# Altium schematic sheet ct_back.SchDoc: Back Panel
size Letter; Organization: NewAE Technology Inc.; Address1: 1083 Queen St., Suite 196; Address2: Halifax; Address3: NS; Address4: Canada B3H 0B2; SheetNumber: 1; SheetTotal: 8; SheetApproved: YES
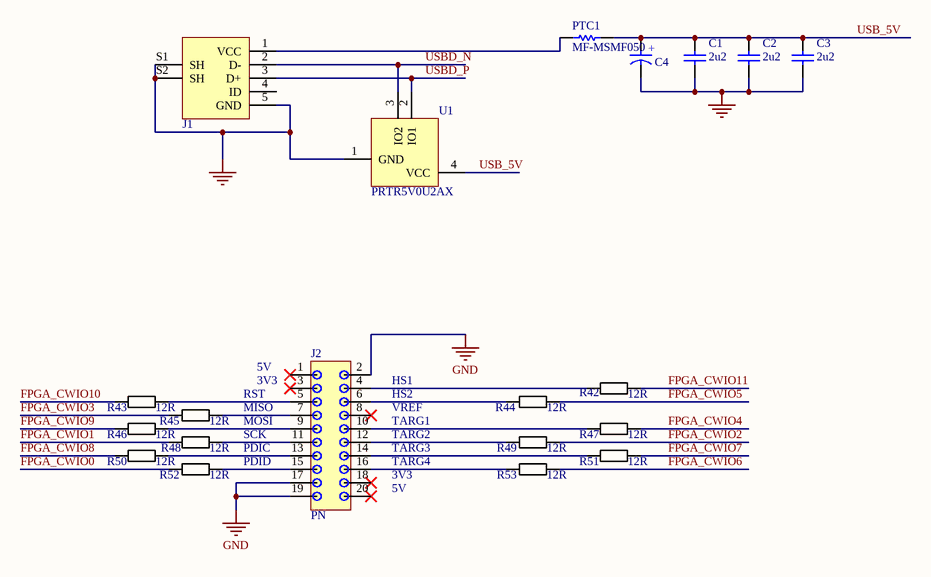
[diagram p0: ct_back.SchDoc]

## Parts
C1  2u2  [CAPC0603_M]
C2  2u2  [CAPC0603_M]
C3  2u2  [CAPC0603_M]
C4  680uF  [Cap_16v_680uF]  (value not drawn)
J1  USB_MicroB_Jack  [ZX62D-B-5P8(30)]  (value not drawn)
J2  PN  [CON-20HDR-EDGEMOUNT]
PTC1  MF-MSMF050  [BOUR-MF-MSMF050-2_V]
R42  12R  [RESC1005X40N]
R43  12R  [RESC1005X40N]
R44  12R  [RESC1005X40N]
R45  12R  [RESC1005X40N]
R46  12R  [RESC1005X40N]
R47  12R  [RESC1005X40N]
R48  12R  [RESC1005X40N]
R49  12R  [RESC1005X40N]
R50  12R  [RESC1005X40N]
R51  12R  [RESC1005X40N]
R52  12R  [RESC1005X40N]
R53  12R  [RESC1005X40N]
U1  PRTR5V0U2AX  [SOT143B]

## Nets
GND: C1.2 C2.2 C3.2 C4.2 J1.5(GND) J1.S1(SH) J1.S2(SH) J2.2 J2.17 J2.19 U1.1(GND)
FPGA_CWIO0: R52.1
FPGA_CWIO1: R48.1
FPGA_CWIO2: R49.2
FPGA_CWIO3: R45.1
FPGA_CWIO4: R47.2
FPGA_CWIO5: R44.2
FPGA_CWIO6: R53.2
FPGA_CWIO7: R51.2
FPGA_CWIO8: R50.1
FPGA_CWIO9: R46.1
FPGA_CWIO10: R43.1
FPGA_CWIO11: R42.2
USB_5V: C1.1 C2.1 C3.1 C4.1 PTC1.2 U1.4(VCC)
USBD_N: J1.2(D-) U1.3(IO2)
USBD_P: J1.3(D+) U1.2(IO1)
NetJ1_1: J1.1(VCC) PTC1.1
NetJ2_4: J2.4 R42.1
NetJ2_5: J2.5 R43.2
NetJ2_6: J2.6 R44.1
NetJ2_7: J2.7 R45.2
NetJ2_9: J2.9 R46.2
NetJ2_10: J2.10 R47.1
NetJ2_11: J2.11 R48.2
NetJ2_12: J2.12 R49.1
NetJ2_13: J2.13 R50.2
NetJ2_14: J2.14 R51.1
NetJ2_15: J2.15 R52.2
NetJ2_16: J2.16 R53.1

Not connected (* = marked no-connect by the designer): J1 4(ID); J2 1* 3* 8* 18(10)* 20(10)*

## Notes on the sheet
- RST
- MISO
- MOSI
- 5V
- 3V3
- (near J2) TARG1
- (near J2) HS1
- (near J2) HS2
- (near J2) VREF
- SCK
- PDIC
- PDID
- (near J2) TARG4
- (near J2) TARG2
- (near J2) TARG3
- (near J2) 3V3
- (near J2) 5V
- Title:
- Date:
- Rev:
- Time:
- Project:
- Sheet
- of
- License:
- Copyright © NewAE Technology Inc.
- Approved:
- NewAE.com
- File:
- (in symbol Cap_16v_680uF) +

## Library data of the parts
C1-C3 = CCHIP-2u2-0603: 2u2, 0603; Manufacture 1: Samsung; Manufacture Part Number 1: CL10B225KP8NNNC; Component Group: Capacitor; Case-EIA: 0603; Case-Metric: 1608; Rated Voltage: 10VDC; Part Number: CCHIP-2u2-0603; Footprint: 0603; Pin Count: 2; Supplier 1: Digi-Key; Supplier Part Number 1: 1276-1134-2-ND; Value: 2u2; Mounting Technology: SMT; Component Kind: Standard; Component Type: Standard
C4 = Cap_16v_680uF: Aluminum electrolytic 680uF, 8x16mm, radial; Component Group: Capacitor; PP Material Stack: 0; Part Number: Cap_16v_680uF; Pin Count: 2; Value: 680uF; Mounting Technology: Through-hole; Component Kind: Standard; Component Type: Standard; PP Rotation: 0
J1 = ZX62D-B-5P8(30): CONN RCPT USB MICRO B SMD; Manufacture 1: Hirose Electric Co Ltd; Component Group: Connector; PP Material Stack: 0; Part Number: ZX62D-B-5P8(30); Manufacture Part Number 1: ZX62D-B-5P8(30); Pin Count: 5; Supplier 1: Digi-Key; Supplier Part Number 1: H125272CT-ND; Mounting Technology: Through-hole; RoHS: Yes; Component Kind: Standard; Component Type: Standard; PP Rotation: 0
J2 = CON20HDR-EDGE: Component Group: Connector; PP Material Stack: 0; Part Number: CON20HDR-EDGE; Pin Count: 20; Component Kind: Standard; Component Type: Standard; PP Rotation: 0; Supplier Part Number 1: S9172-ND; Supplier 1: Digi-Key
PTC1 = CMP-0280-00002-2: MF-MSMF Series - PTC Resettable Fuse, 15 V Max, 0.15 Ohm Min, -40 to 85 degC, RoHS, Reel; Manufacturer: Bourns; Voltage DC (Max): 15 V; Trip Current: 1 A; Hold Current: 0.5 A; Current Rating (Max): 100 A; ComponentLink1Description: Manufacturer URL; Operating Temperature Range: -40 to 85 degC; ComponentLink2URL: http://www.bourns.com/data/global/pdfs/mfmsmf.pdf; PackageReference: MF-MSMF050; ComponentLink2Description: Datasheet; PartNumber: MF-MSMF050; DatasheetVersion: Rev. AD; ComponentLink3URL: http://www.bourns.com/data/global/pdfs/mfmsmf.pdf; ComponentLink3Description: Package Specification; RoHS: TRUE; PackageDescription: 2-Pin SMD, Body 4.55 x 3.24 mm; Mounting Technology: Surface Mount; Packing: Reel; Resistance (Min): 0.15 Ohm; ComponentLink1URL: http://www.bourns.com/; Supplier 1: Digi-Key; Supplier Part Number 1: MF-MSMF050-2CT-ND
R42-R53 = RCHIP-12R-0402: 12R res, 0402, 1%, 1/16W; Manufacture 1: Yageo; Manufacture Part Number 1: RC0402FR-0712RL; Component Group: Resistor; Case-EIA: 0402; Case-Metric: 1005; Rated Power: 0.063W; Rated Voltage: 75VDC; Part Number: RCHIP-12R-0402; Footprint: 0402; Pin Count: 2; Supplier 1: Digi-Key; Supplier Part Number 1: YAG2968CT-ND; Value: 12R; Tolerance: 1%; Mounting Technology: SMT; Temperature Range: -55C to 155C; Component Kind: Standard; Component Type: Standard
U1 = PRTR5V0U2AX: USB 2.0 high-speed ESD; Component Group: Diode; Supplier 1: Digi-Key; Supplier Part Number 1: 568-7445-1-ND; Part Number: PRTR5V0U2AX; Pin Count: 4; Component Kind: Standard; Component Type: Standard